# Altium schematic sheet stlink.SchDoc
size A4
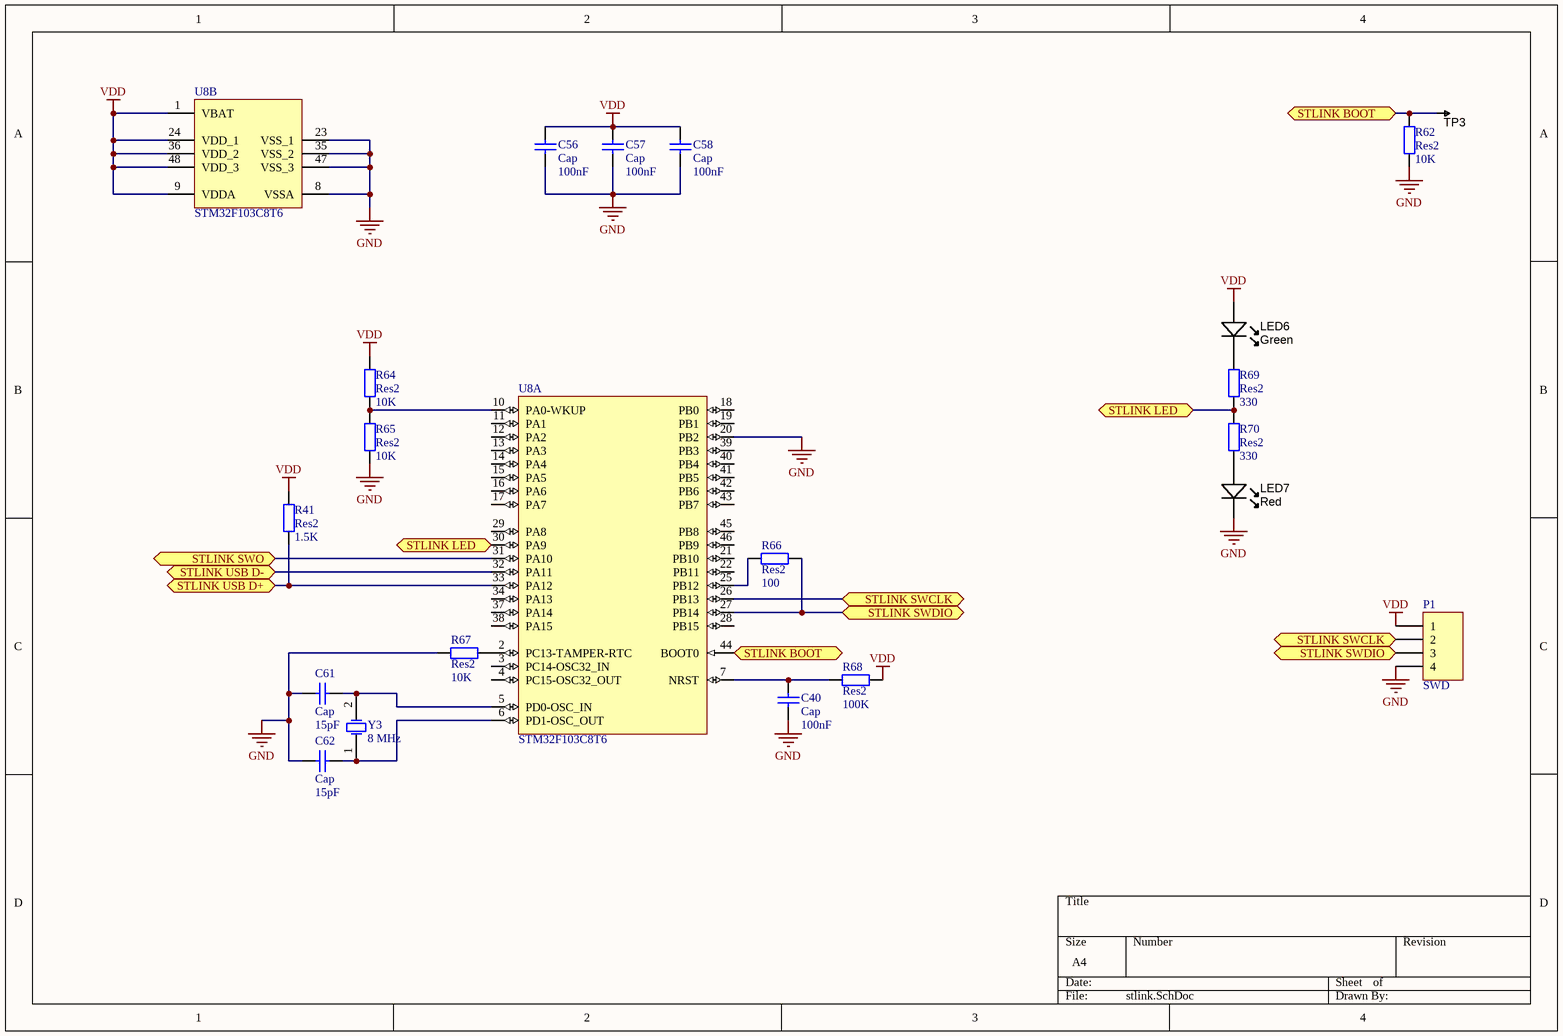
[diagram p0: stlink.SchDoc]

## Parts
C40  Cap  value 100nF  [CAPC2012X135N]
C56  Cap  value 100nF  [CAPC2012X135N]
C57  Cap  value 100nF  [CAPC2012X135N]
C58  Cap  value 100nF  [CAPC2012X135N]
C61  Cap  value 15pF  [CAPC2012X135N]
C62  Cap  value 15pF  [CAPC2012X135N]
LED6  value Green  [LED-0805-K]  (hidden comment: B0)
LED7  value Red  [LED-0805-K]  (hidden comment: B0)
P1  SWD  [HDR1X4]
R41  Res2  value 1.5K  [RESC2012X70N]
R62  Res2  value 10K  [RESC2012X70N]
R64  Res2  value 10K  [RESC2012X70N]
R65  Res2  value 10K  [RESC2012X70N]
R66  Res2  value 100  [RESC2012X70N]
R67  Res2  value 10K  [RESC2012X70N]
R68  Res2  value 100K  [RESC2012X70N]
R69  Res2  value 330  [RESC2012X70N]
R70  Res2  value 330  [RESC2012X70N]
TP3  TESTPOINT  [TP-R60]  (value not drawn)  (no BOM)
U8  STM32F103C8T6  [STM-LQFP48_N]  (parts A,B of 2)
Y3  8 MHz  [HC49/4H_SMX]

## Ports
STLINK BOOT, STLINK LED, STLINK SWCLK (bidir), STLINK SWDIO (bidir), STLINK SWO (bidir), STLINK USB D+ (bidir), STLINK USB D- (bidir)

## Nets
GND: C40.1 C56.1 C57.1 C58.1 C61.2 C62.1 LED7.K P1.4 R62.1 R65.1 R67.2 U8.8(VSSA) U8.20(PB2) U8.23(VSS_1) U8.35(VSS_2) U8.47(VSS_3)
VDD: C56.2 C57.2 C58.2 LED6.A P1.1 R41.2 R64.2 R68.1 U8.1(VBAT) U8.9(VDDA) U8.24(VDD_1) U8.36(VDD_2) U8.48(VDD_3)
STLINK BOOT: R62.2 TP3.1 U8.44(BOOT0) ; port STLINK BOOT
STLINK LED: R69.1 R70.2 U8.30(PA9) ; port STLINK LED
STLINK SWCLK: P1.2 U8.26(PB13) ; port STLINK SWCLK
STLINK SWDIO: P1.3 R66.1 U8.27(PB14) ; port STLINK SWDIO
STLINK SWO: U8.31(PA10) ; port STLINK SWO
STLINK USB D+: R41.1 U8.33(PA12) ; port STLINK USB D+
STLINK USB D-: U8.32(PA11) ; port STLINK USB D-
NetC40_2: C40.2 R68.2 U8.7(NRST)
NetC61_1: C61.1 U8.5(PD0-OSC_IN) Y3.2(OSC2)
NetC62_2: C62.2 U8.6(PD1-OSC_OUT) Y3.1(OSC1)
NetLED6_K: LED6.K R69.2
NetLED7_A: LED7.A R70.1
NetR64_1: R64.1 R65.2 U8.10(PA0-WKUP)
NetR66_2: R66.2 U8.25(PB12)
NetR67_1: R67.1 U8.2(PC13-TAMPER-RTC)

Not connected (* = marked no-connect by the designer): U8 3(PC14-OSC32_IN) 4(PC15-OSC32_OUT) 11(PA1) 12(PA2) 13(PA3) 14(PA4) 15(PA5) 16(PA6) 17(PA7) 18(PB0) 19(PB1) 21(PB10) 22(PB11) 28(PB15) 29(PA8) 34(PA13) 37(PA14) 38(PA15) 39(PB3) 40(PB4) 41(PB5) 42(PB6) 43(PB7) 45(PB8) 46(PB9)

## Library data of the parts
C40 C56-C58 C61 C62 = Cap: Capacitor; Published: 8-Jun-2000; LatestRevisionDate: 17-Jul-2002; LatestRevisionNote: Re-released for DXP Platform.; PackageReference: RAD-0.3; Publisher: Altium Limited; PackageDescription: Radial Cap, Thru-Hole; 2 Leads; 0.3 in Pin Spacing
LED6 LED7 = LED_SMD_Red_0805_6mcd: LED 0805 SMD Red 6mcd 621nm; Manufacturer 1: Lite-On Inc; Manufacturer Part Number 1: LTST-C171EKT; Material: GaAsP on GaP; Ratings: 6 mcd; 621 nm; SCDType: source; Package / Case: 0805; Supplier 1: Digi-Key; Supplier Part Number 1: 160-1422-1-ND
  LED6: Color: Green
  LED7: Color: Red
P1 = Header 4: Header, 4-Pin; LatestRevisionDate: 17-Jul-2002; LatestRevisionNote: Re-released for DXP Platform.; Publisher: Altium Limited
R41 R62 R64-R70 = Res2: Resistor; Published: 8-Jun-2000; LatestRevisionDate: 17-Jul-2002; LatestRevisionNote: Re-released for DXP Platform.; PackageReference: AXIAL-0.4; Publisher: Altium Limited; PackageDescription: Axial Device, Thru-Hole; 2 Leads; 0.4 in Pin Spacing
TP3 = TESTPOINT: SMD test pin
U8 = STM32F103C8T6: ARM Cortex-M3 32-bit MCU, 64 KB Flash, 20 KB Internal RAM, 37 I/Os, 48-pin LQFP, -40 to 85 degC, Tray; A/D Converter: 2x12-bit (10 Channel); FLASH Size (Prog) (kB): 64; I/Os (High Current): 37; Internal RAM Size (kB): 20; Operating Frequency(F) (Processor speed) (MHz): 72; Supply Voltage(Vcc) min (V): 2; DatasheetVersion: Rev. 16; PackageVersion: Rev. 6, 06/2013; PackageReference: LQFP48; PackageDescription: 48-Pin Low Profile Quad Flat Package, 7 x 7 mm Body, 0.5 mm Pitch; Supplier 1: Digi-Key; Supplier Part Number 1: 497-6063-ND; Supplier 2: Farnell; Supplier Part Number 2: 1447637; Supplier 3: Newark; Supplier Part Number 3: 59M2182; Supplier 4: Newark; Supplier Part Number 4: 57P1222; Supplier 5: Mouser; Supplier Part Number 5: 511-STM32F103C8T6; Core: ARM Cortex-M3; Packing: Tray; Mounting Technology: Surface Mount; PartNumber: STM32F103C8T6; ComponentLink1Description: Manufacturer URL; ComponentLink1URL: http://www.st.com/web/en/home.html; ComponentLink2Description: Datasheet; ComponentLink2URL: http://www.st.com/st-web-ui/static/active/en/resource/technical/document/datasheet/CD00161566.pdf; ComponentLink3Description: Package Specification; ComponentLink3URL: http://www.st.com/st-web-ui/static/active/en/resource/technical/document/datasheet/DM00058181.pdf
Y3 = HC49/4H_SMX: Surface Mount Quartz Crystal; Note: PCB layout complies with manufacturer's recommendation.; Published: 17-Jul-2002; DatasheetDocument: 18-Oct-1999; PackageDocument: 18-Oct-1999; PackageReference: HC49/4H_SMX; Publisher: Altium Limited; ComponentLink1Description: Manufacturer Link; ComponentLink1URL: http://www.cmac.com/mt/; ComponentLink2Description: Datasheet; ComponentLink2URL: http://www.cmac.com/mt/databook/crystals/smd/hc49_4h_smx.pdf